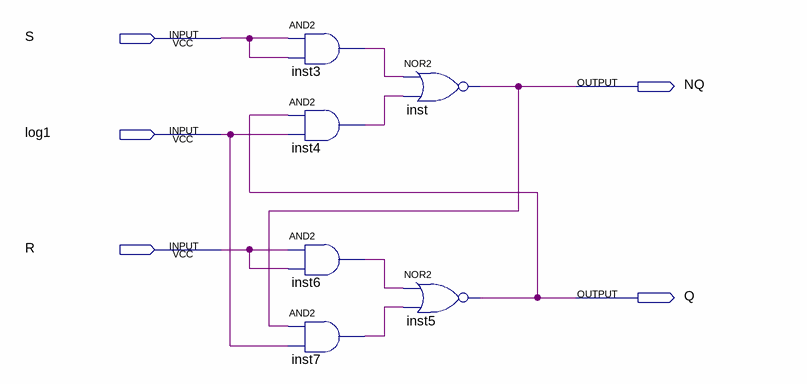
[diagram p0: schematic sheet]
// Quartus schematic 2_2_AND_OR_NOT.bdf as structural Verilog: 6 symbols, 5 pins
module \2_2_AND_OR_NOT  (
  input  S,
  input  log1,
  input  R,
  output NQ,
  output Q
);

  wire inst3_out, inst4_out, inst6_out, inst7_out;

  and inst3 (inst3_out, S, S);
  and inst4 (inst4_out, Q, log1);
  and inst6 (inst6_out, R, R);
  and inst7 (inst7_out, NQ, log1);
  nor inst (NQ, inst3_out, inst4_out);
  nor inst5 (Q, inst6_out, inst7_out);
endmodule
